# Altium schematic sheet servox15_layout_board.SchDoc
size A4
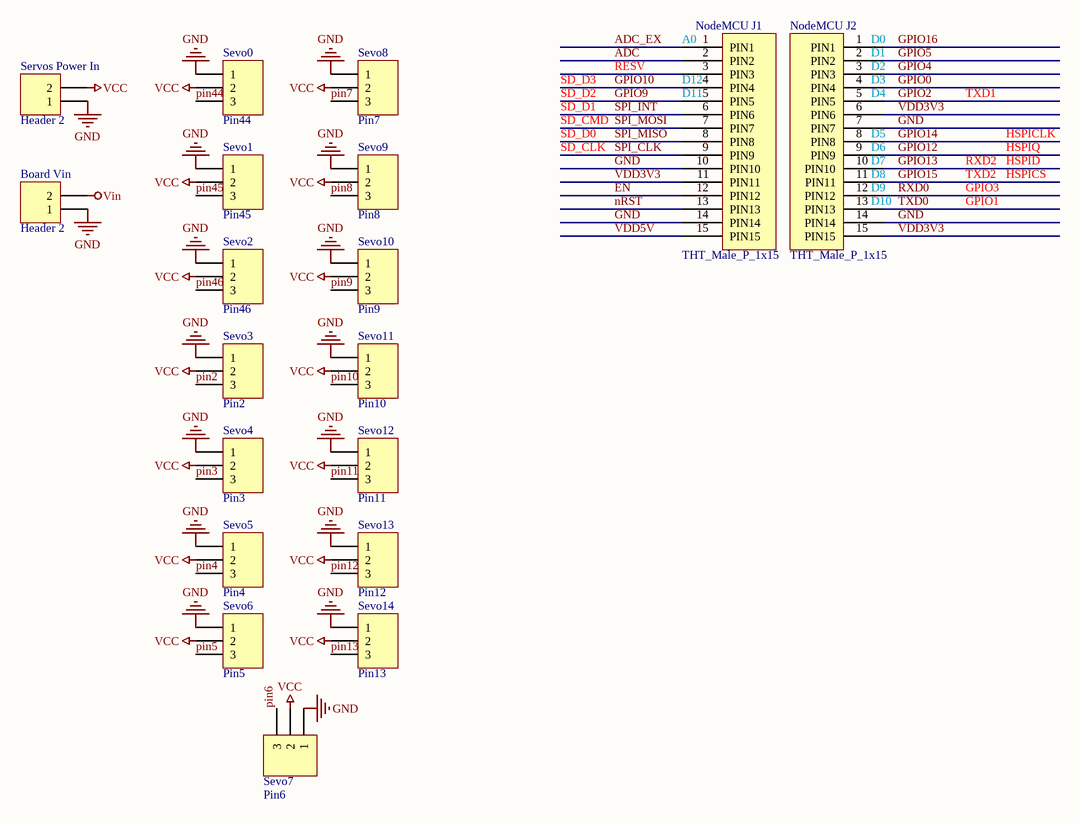
[diagram p0: servox15_layout_board.SchDoc]

## Parts
Board_Vin  Header 2  [HDR1X2]
NodeMCU_J1  THT_Male_P_1x15  [THT_Male_P_1x15-2.54mm]
NodeMCU_J2  THT_Male_P_1x15  [THT_Male_P_1x15-2.54mm]
Servos_Power_In  Header 2  [HDR1X2]
Sevo0  Pin44  [HDR1X3]
Sevo1  Pin45  [HDR1X3]
Sevo2  Pin46  [HDR1X3]
Sevo3  Pin2  [HDR1X3]
Sevo4  Pin3  [HDR1X3]
Sevo5  Pin4  [HDR1X3]
Sevo6  Pin5  [HDR1X3]
Sevo7  Pin6  [HDR1X3]
Sevo8  Pin7  [HDR1X3]
Sevo9  Pin8  [HDR1X3]
Sevo10  Pin9  [HDR1X3]
Sevo11  Pin10  [HDR1X3]
Sevo12  Pin11  [HDR1X3]
Sevo13  Pin12  [HDR1X3]
Sevo14  Pin13  [HDR1X3]

## Nets
GND: Board_Vin.1 NodeMCU_J1.10(PIN10) NodeMCU_J1.14(PIN14) NodeMCU_J2.7(PIN7) NodeMCU_J2.14(PIN14) Servos_Power_In.1 Sevo0.1 Sevo1.1 Sevo2.1 Sevo3.1 Sevo4.1 Sevo5.1 Sevo6.1 Sevo7.1 Sevo8.1 Sevo9.1 Sevo10.1 Sevo11.1 Sevo12.1 Sevo13.1 Sevo14.1
VCC: Servos_Power_In.2 Sevo0.2 Sevo1.2 Sevo2.2 Sevo3.2 Sevo4.2 Sevo5.2 Sevo6.2 Sevo7.2 Sevo8.2 Sevo9.2 Sevo10.2 Sevo11.2 Sevo12.2 Sevo13.2 Sevo14.2
Vin: Board_Vin.2
ADC: NodeMCU_J1.2(PIN2)
ADC_EX: NodeMCU_J1.1(PIN1)
EN: NodeMCU_J1.12(PIN12)
GPIO0: NodeMCU_J2.4(PIN4)
GPIO2: NodeMCU_J2.5(PIN5)
GPIO4: NodeMCU_J2.3(PIN3)
GPIO5: NodeMCU_J2.2(PIN2)
GPIO9: NodeMCU_J1.5(PIN5)
GPIO10: NodeMCU_J1.4(PIN4)
GPIO12: NodeMCU_J2.9(PIN9)
GPIO13: NodeMCU_J2.10(PIN10)
GPIO14: NodeMCU_J2.8(PIN8)
GPIO15: NodeMCU_J2.11(PIN11)
GPIO16: NodeMCU_J2.1(PIN1)
nRST: NodeMCU_J1.13(PIN13)
pin2: Sevo3.3
pin3: Sevo4.3
pin4: Sevo5.3
pin5: Sevo6.3
pin6: Sevo7.3
pin7: Sevo8.3
pin8: Sevo9.3
pin9: Sevo10.3
pin10: Sevo11.3
pin11: Sevo12.3
pin12: Sevo13.3
pin13: Sevo14.3
pin44: Sevo0.3
pin45: Sevo1.3
pin46: Sevo2.3
RXD0: NodeMCU_J2.12(PIN12)
SPI_CLK: NodeMCU_J1.9(PIN9)
SPI_INT: NodeMCU_J1.6(PIN6)
SPI_MISO: NodeMCU_J1.8(PIN8)
SPI_MOSI: NodeMCU_J1.7(PIN7)
TXD0: NodeMCU_J2.13(PIN13)
VDD3V3: NodeMCU_J1.11(PIN11) NodeMCU_J2.6(PIN6) NodeMCU_J2.15(PIN15)
VDD5V: NodeMCU_J1.15(PIN15)

Not connected (* = marked no-connect by the designer): NodeMCU_J1 3(PIN3)

## Notes on the sheet
- SD_D3
- RESV
- (near NodeMCU_J1) A0
- (near NodeMCU_J1) D12
- (near NodeMCU_J2) D0
- (near NodeMCU_J2) D1
- (near NodeMCU_J2) D2
- (near NodeMCU_J2) D3
- SD_CLK
- SD_D0
- SD_CMD
- SD_D1
- SD_D2
- (near NodeMCU_J1) D11
- (near NodeMCU_J2) D4
- (near NodeMCU_J2) D5
- (near NodeMCU_J2) D6
- TXD1
- HSPICLK
- HSPIQ
- (near NodeMCU_J2) D7
- (near NodeMCU_J2) D8
- (near NodeMCU_J2) D9
- (near NodeMCU_J2) D10
- TXD2
- RXD2
- GPIO3
- GPIO1
- HSPID
- HSPICS

## Library data of the parts
Board_Vin Servos_Power_In = Header 2: Header, 2-Pin; LatestRevisionDate: 17-Jul-2002; LatestRevisionNote: Re-released for DXP Platform.; Publisher: Altium Limited
NodeMCU_J1 NodeMCU_J2 = THT_Male_P_1x15: THT Male pin header strip 1x15
Sevo0-Sevo14 = Header 3: Header, 3-Pin; LatestRevisionDate: 17-Jul-2002; LatestRevisionNote: Re-released for DXP Platform.; Publisher: Altium Limited